# EAGLE schematic New Buggy 2015 (EAGLE 7.2.0)
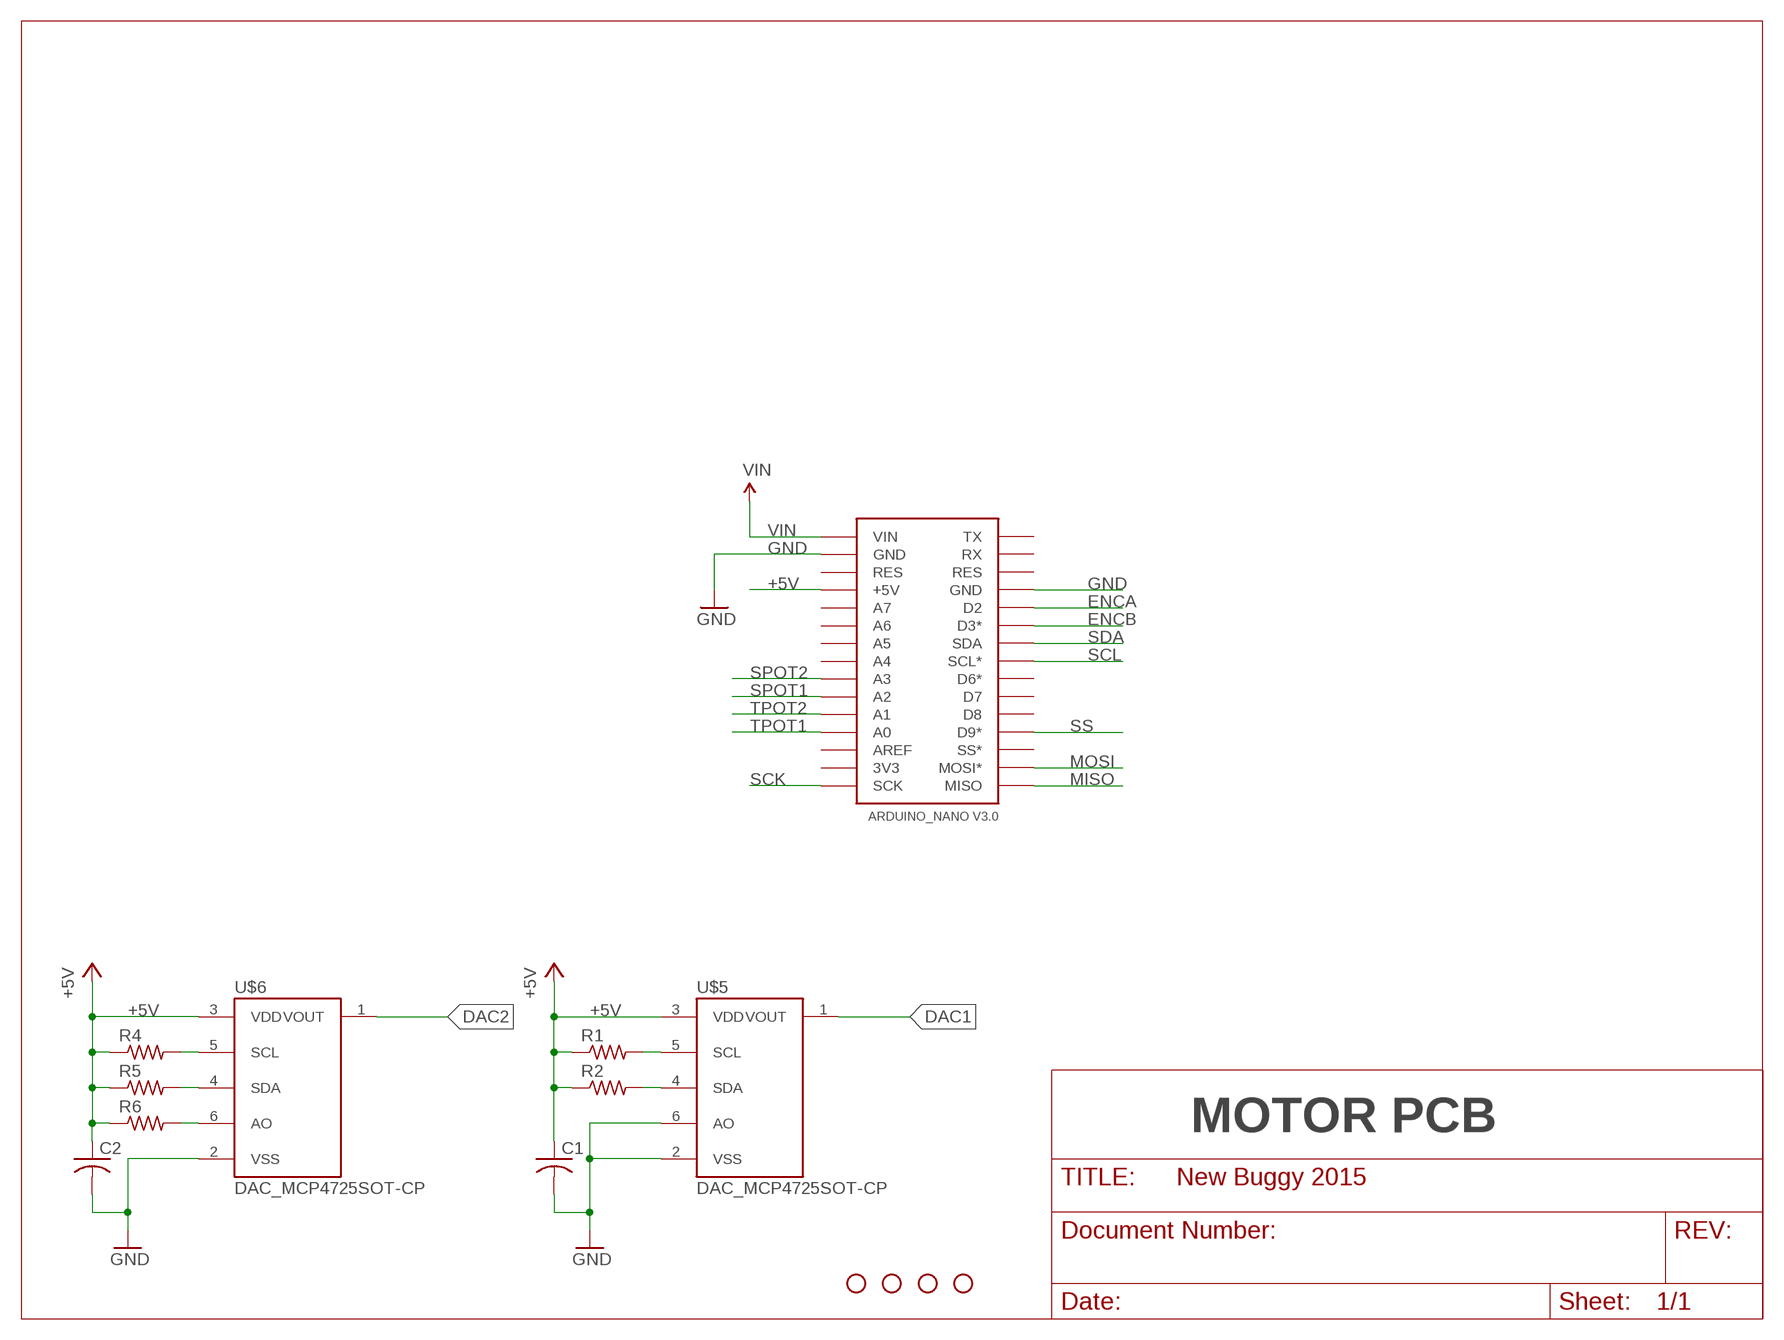
[diagram p0: schematic, sheet 1]

## Parts
C1  C-USC1206  [C1206]
C2  C-USC1206  [C1206]
R1  R-US_R1206  [R1206]
R2  R-US_R1206  [R1206]
R4  R-US_R1206  [R1206]
R5  R-US_R1206  [R1206]
R6  R-US_R1206  [R1206]
STANDOFF1  STAND-OFF  [STAND-OFF]
STANDOFF2  STAND-OFF  [STAND-OFF]
STANDOFF3  STAND-OFF  [STAND-OFF]
STANDOFF4  STAND-OFF  [STAND-OFF]
U$3  ARDUINO_NANO  [ARDUINO_NANO]
U$5  DAC_MCP4725SOT-CP  [SOT23-6-MCP4725]
U$6  DAC_MCP4725SOT-CP  [SOT23-6-MCP4725]

## Nets
+5V: C1.1 C2.1 R1.1 R2.1 R4.1 R5.1 R6.1 U$3.+5V U$5.3(VDD) U$6.3(VDD)
DAC1: U$5.1(VOUT)
DAC2: U$6.1(VOUT)
ENCA: U$3.D2
ENCB: U$3.D3*
GND: C1.2 C2.2 U$3.GND U$3.GND@1(GND) U$5.2(VSS) U$5.6(AO) U$6.2(VSS)
MISO: U$3.MISO
MOSI: U$3.MOSI*
N$8: R6.2 U$6.6(AO)
SCK: U$3.SCK
SCL: R1.2 R4.2 U$3.SCL* U$5.5(SCL) U$6.5(SCL)
SDA: R2.2 R5.2 U$3.SDA U$5.4(SDA) U$6.4(SDA)
SPOT1: U$3.A2
SPOT2: U$3.A3
SS: U$3.D9*
TPOT1: U$3.A0
TPOT2: U$3.A1
VIN: U$3.VIN
Unconnected: U$3.3V3 U$3.A4 U$3.A5 U$3.A6 U$3.A7 U$3.AREF U$3.D6* U$3.D7 U$3.D8 U$3.RES U$3.RES@1(RES) U$3.RX U$3.SS* U$3.TX

## Notes on the sheet
- MOTOR PCB

## Library data of the parts
C1 C2 = rcl:C-US: CAPACITOR, American symbol
R1 R2 R4-R6 = resistor:R-US_: RESISTOR, American symbol
STANDOFF1-STANDOFF4 = SparkFun-Electromechanical:STAND-OFF: #4 Stand Off This is the mechanical footprint for a #4 phillips button head screw. Use the keepout ring to avoid running the screw head into surrounding components. SKU : PRT-00447
U$3 = Wetmelon-Boards:ARDUINO_NANO
U$5 U$6 = SparkFun-AnalogIC:DAC_MCP4725: Microchip 12-bit I2C DAC, SOT23-6